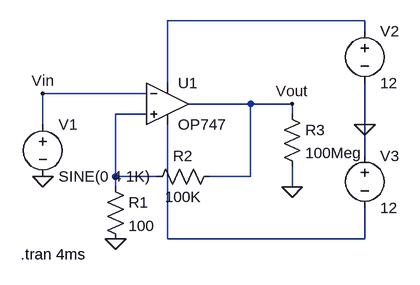
[diagram p0: schematic SCHMIDTH_TRIGGER.asc]
SCHMIDTH_TRIGGER.asc, the LTspice schematic file:
Version 4
SHEET 1 880 680
WIRE 480 -64 176 -64
WIRE 480 -48 480 -64
WIRE 176 32 176 -64
WIRE 144 48 -16 48
WIRE 304 64 208 64
WIRE 368 64 304 64
WIRE 144 80 96 80
WIRE 368 80 368 64
WIRE -16 96 -16 48
WIRE 480 96 480 32
WIRE 480 144 480 96
WIRE 96 176 96 80
WIRE 160 176 96 176
WIRE 304 176 304 64
WIRE 304 176 240 176
WIRE 96 192 96 176
WIRE 368 192 368 160
WIRE 176 272 176 96
WIRE 480 272 480 224
WIRE 480 272 176 272
FLAG 368 192 0
FLAG 96 272 0
FLAG -16 176 0
FLAG 480 96 0
FLAG 368 64 Vout
FLAG -16 48 Vin
SYMBOL OpAmps\\OP747 176 0 R0
SYMATTR InstName U1
SYMBOL voltage -16 80 R0
WINDOW 123 0 0 Left 0
WINDOW 39 0 0 Left 0
SYMATTR InstName V1
SYMATTR Value SINE(0 4 1K)
SYMBOL res 80 176 R0
SYMATTR InstName R1
SYMATTR Value 100
SYMBOL res 256 160 R90
WINDOW 0 0 56 VBottom 2
WINDOW 3 32 56 VTop 2
SYMATTR InstName R2
SYMATTR Value 100K
SYMBOL res 352 64 R0
SYMATTR InstName R3
SYMATTR Value 100Meg
SYMBOL voltage 480 -64 R0
WINDOW 123 0 0 Left 0
WINDOW 39 0 0 Left 0
SYMATTR InstName V2
SYMATTR Value 12
SYMBOL voltage 480 128 R0
WINDOW 123 0 0 Left 0
WINDOW 39 0 0 Left 0
SYMATTR InstName V3
SYMATTR Value 12
TEXT -50 296 Left 2 !.tran 4ms

The netlist it stands for:
* SCHMIDTH_TRIGGER.asc
XU1 N002 Vin N001 N003 Vout OP747  ; pins In+ In- V+ V- OUT
V1 Vin 0 SINE(0 4 1K)
R1 N002 0 100
R2 Vout N002 100K
R3 Vout 0 100Meg
V2 N001 0 12
V3 0 N003 12
.tran 4ms
.backanno
.end